# EAGLE schematic CC2640_interface (EAGLE 6.6.0)

## Sheet 1 of 2
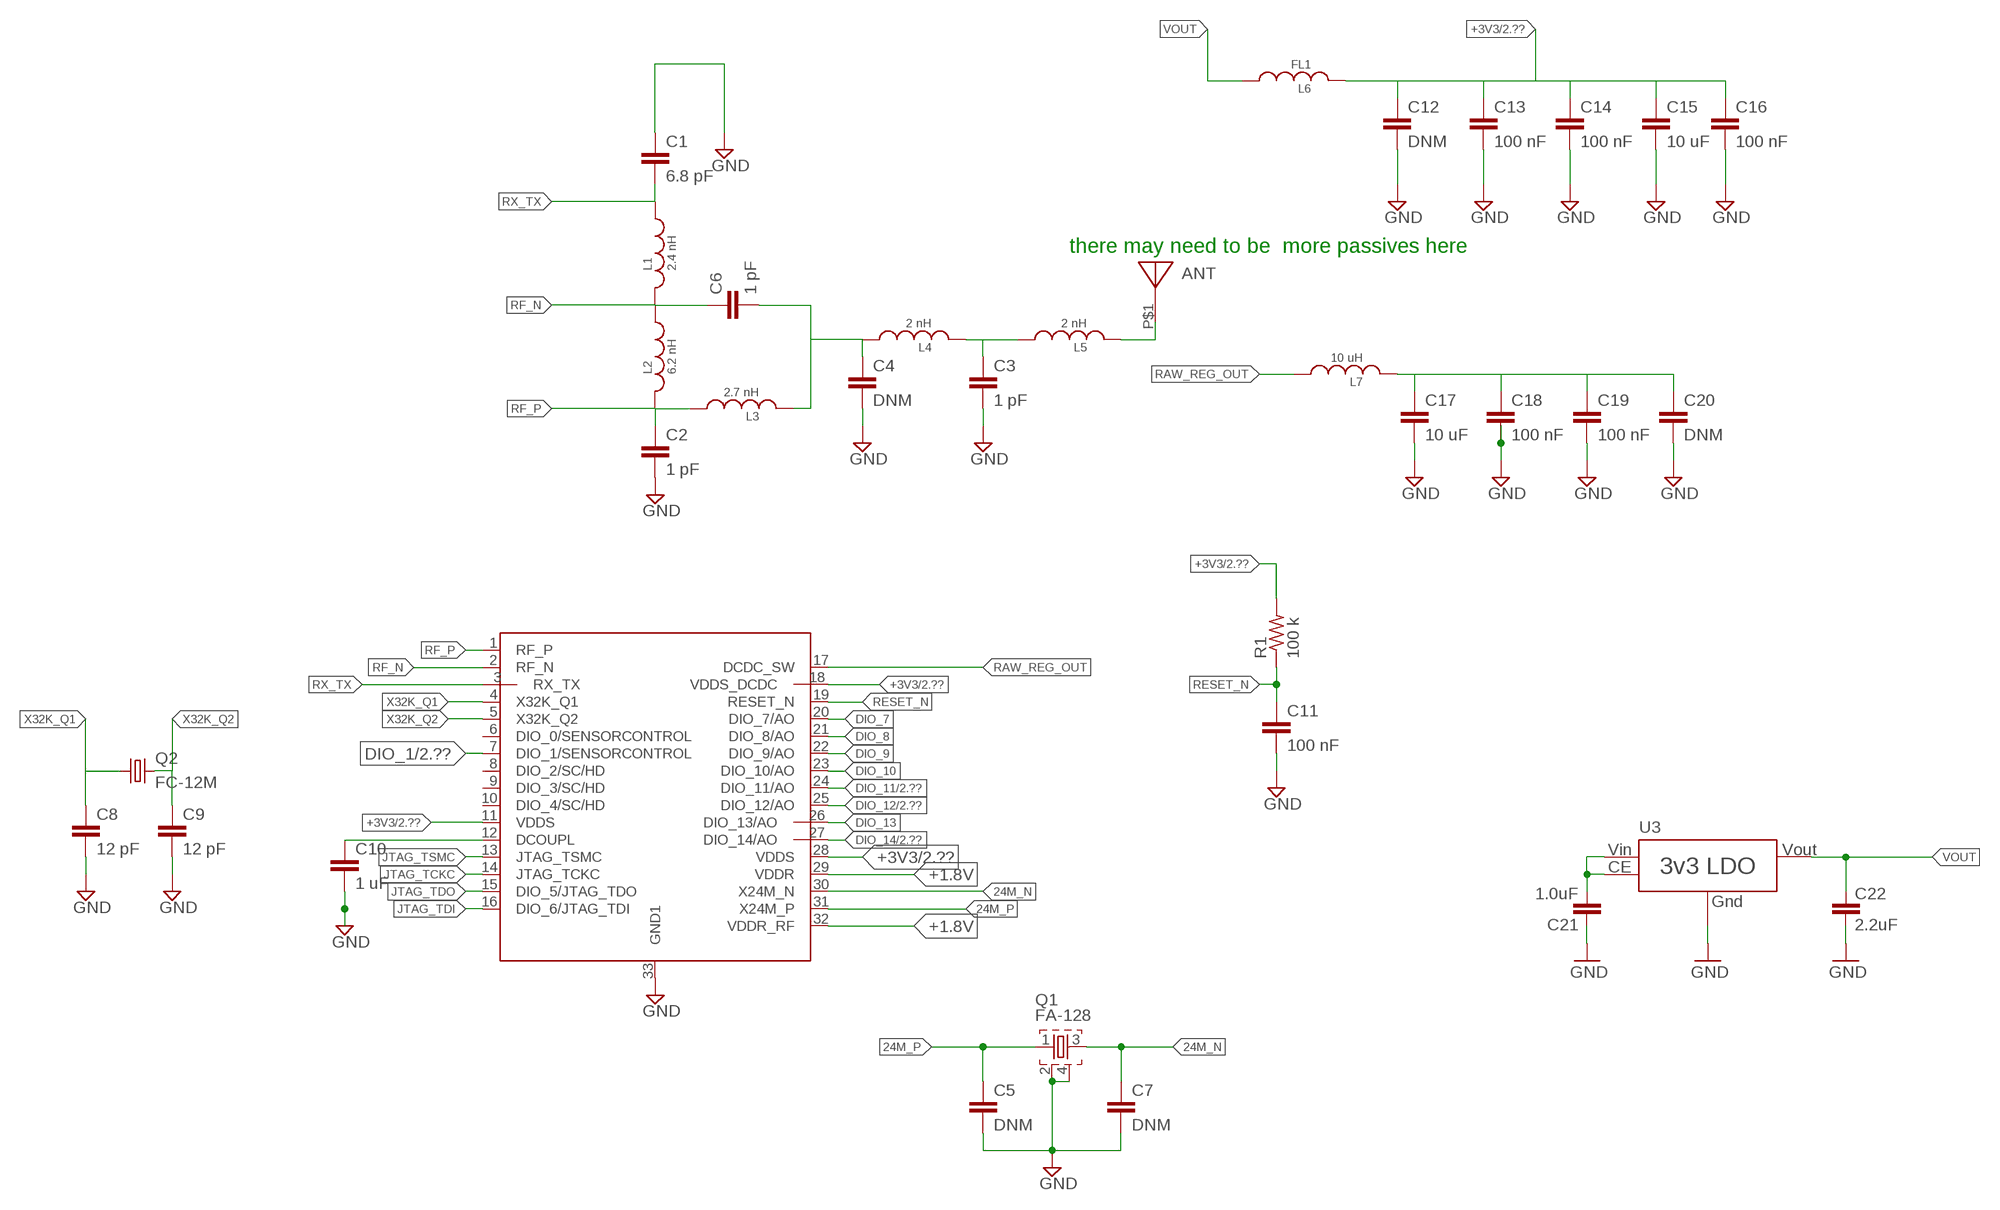
[diagram p0: schematic, sheet 1]

### Parts
ANT  2450AT18A100  [2450AT18A100]
C1  6.8 pF  C-EUC0402  [C0402]
C2  1 pF  C-EUC0402  [C0402]
C3  1 pF  C-EUC0402  [C0402]
C4  DNM  C-EUC0402  [C0402]
C5  DNM  C-EUC0402  [C0402]
C6  1 pF  C-EUC0402  [C0402]
C7  DNM  C-EUC0402  [C0402]
C8  12 pF  C-EUC0402  [C0402]
C9  12 pF  C-EUC0402  [C0402]
C10  1 uF  C-EUC0402  [C0402]
C11  100 nF  C-EUC0402  [C0402]
C12  DNM  C-EUC0402  [C0402]
C13  100 nF  C-EUC0402  [C0402]
C14  100 nF  C-EUC0402  [C0402]
C15  10 uF  C-EUC0402  [C0402]
C16  100 nF  C-EUC0402  [C0402]
C17  10 uF  C-EUC0402  [C0402]
C18  100 nF  C-EUC0402  [C0402]
C19  100 nF  C-EUC0402  [C0402]
C20  DNM  C-EUC0402  [C0402]
C21  1.0uF  C-EUC0805  [C0805]
C22  2.2uF  C-EUC0805  [C0805]
L1  2.4 nH  INDUCTOR0603  [0603_CAP]
L2  6.2 nH  INDUCTOR0603  [0603_CAP]
L3  2.7 nH  INDUCTOR0603  [0603_CAP]
L4  2 nH  INDUCTOR0603  [0603_CAP]
L5  2 nH  INDUCTOR0603  [0603_CAP]
L6  FL1  INDUCTOR0603  [0603_CAP]
L7  10 uH  INDUCTOR0603  [0603_CAP]
Q1  FA-128  [FA-128]
Q2  FC-12M  [FC-12M]
R1  100 k  R-US_R0402  [R0402]
U3  XC6210  [SOT-25]
U$1  CC2640-5MM  [S-PVQFN-N32]

### Nets
24M_N: C7.1 Q1.3 U$1.30(X24M_N)
24M_P: C5.1 Q1.1 U$1.31(X24M_P)
+1.8V: C17.1 C18.1 C19.1 C20.1 L7.2 U$1.29(VDDR) U$1.32(VDDR_RF)
+3V3: C12.1 C13.1 C14.1 C15.1 C16.1 L6.2 R1.2 U$1.11(VDDS) U$1.18(VDDS_DCDC) U$1.28(VDDS) ; also sheet 2
DCOUPLE_ME: C10.1 U$1.12(DCOUPL)
DIO_1: U$1.7(DIO_1/SENSORCONTROL) ; also sheet 2
DIO_7: U$1.20(DIO_7/AO)
DIO_8: U$1.21(DIO_8/AO)
DIO_9: U$1.22(DIO_9/AO)
DIO_10: U$1.23(DIO_10/AO)
DIO_11: U$1.24(DIO_11/AO) ; also sheet 2
DIO_12: U$1.25(DIO_12/AO) ; also sheet 2
DIO_13: U$1.26(DIO_13/AO)
DIO_14: U$1.27(DIO_14/AO) ; also sheet 2
GND: C1.1 C2.2 C3.2 C4.2 C5.2 C7.2 C8.2 C9.2 C10.2 C11.2 C12.2 C13.2 C14.2 C15.2 C16.2 C17.2 C18.2 C19.2 C20.2 C21.1 C22.2 Q1.2 Q1.4 U3.2(GND) U$1.33(GND1) ; also sheet 2
JTAG_TCKC: U$1.14(JTAG_TCKC)
JTAG_TDI: U$1.16(DIO_6/JTAG_TDI)
JTAG_TDO: U$1.15(DIO_5/JTAG_TDO)
JTAG_TSMC: U$1.13(JTAG_TSMC)
N$4: C4.1 C6.2 L3.2 L4.1
N$5: C3.1 L4.2 L5.1
N$7: ANT.P$1 L5.2
RAW_REG_OUT: L7.1 U$1.17(DCDC_SW)
RESET_N: C11.1 R1.1 U$1.19(RESET_N)
RF_N: C6.1 L1.2 L2.1 U$1.2(RF_N)
RF_P: C2.1 L2.2 L3.1 U$1.1(RF_P)
RX_TX: C1.2 L1.1 U$1.3(RX_TX)
VBATT: C21.2 U3.1(VIN) U3.3(CE)
VOUT: C22.1 L6.1 U3.5(VOUT)
X32K_Q1: C8.1 Q2.1 U$1.4(X32K_Q1)
X32K_Q2: C9.1 Q2.2 U$1.5(X32K_Q2)
Unconnected: U$1.6(DIO_0/SENSORCONTROL) U$1.8(DIO_2/SC/HD) U$1.9(DIO_3/SC/HD) U$1.10(DIO_4/SC/HD)

### Notes on the sheet
- there may need to be  more passives here

## Sheet 2 of 2
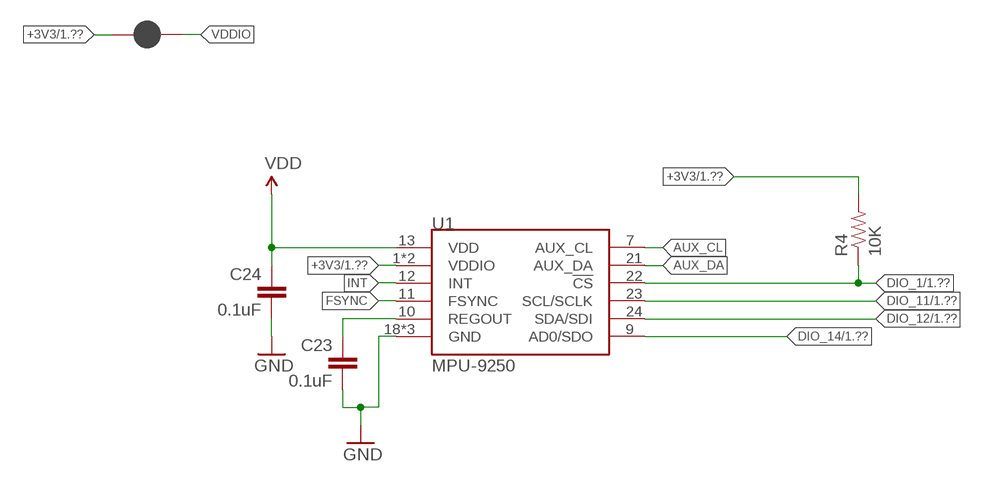
[diagram p1: schematic, sheet 2]

### Parts
C23  0.1uF  0.1UF-25V(+80/-20%)(0603)  [0603-CAP]
C24  0.1uF  0.1UF-25V(+80/-20%)(0603)  [0603-CAP]
R4  10K  10KOHM-1/10W-1%(0603)0603  [0603-RES]
SJ1  JUMPER-PAD-2-NC_BY_PASTEFULL-BOX-SILK  [PAD-JUMPER-2-NC_BY_PASTE_YES_SILK_FULL_BOX]
U1  MPU-9250  [QFN24_PAD]

### Nets
+3V3: C24.1 R4.2 SJ1.1 U1.1(VDDIO) U1.8(VDDIO) U1.13(VDD) ; supply symbol labelled VDD ; also sheet 1
ADSD_STUB: U1.9(AD0/SDO)
AUX_CL: U1.7(AUX_CL)
AUX_DA: U1.21(AUX_DA)
DIO_1: R4.1 U1.22(!CS) ; also sheet 1
DIO_11: U1.23(SCL/SCLK) ; also sheet 1
DIO_12: U1.24(SDA/SDI) ; also sheet 1
FSYNC: U1.11(FSYNC)
GND: C23.2 C24.2 U1.18(GND) U1.20(GND) U1.CENTER(GND) ; also sheet 1
INT: U1.12(INT)
REGOUT: C23.1 U1.10(REGOUT)
VDDIO: SJ1.2

## Library data of the parts
ANT = Johanson_antenna:2450AT18A100
C1-C20 = rcl:C-EU: CAPACITOR, European symbol
C21 C22 = Jon_LIB:C-EU: CAPACITOR, European symbol
C23 C24 = SparkFun-Capacitors:0.1UF-25V(+80/-20%)(0603): CAP-00810 Ceramic Standard decoupling cap; PROD_ID: CAP-00810
L1-L7 = passives:INDUCTOR: A very specific inductor
Q1 = crystal:FA-: MHz RANGE CRYSTAL UNIT Source: Epson Toyocom
Q2 = crystal:FC-12M: kHz RANGE CRYSTAL UNIT LOW PROFILE SMD Source: Epson Toyocom FC-12M.pdf
R1 = rcl:R-US_: RESISTOR, American symbol
R4 = SparkFun-Resistors:10KOHM-1/10W-1%(0603): RES-00824; PROD_ID: RES-00824
SJ1 = SparkFun-Passives:JUMPER-PAD-2-NC_BY_PASTE
U1 = Testing:MPU-9250: NC pin 19. 2-6 & 14-17 not internally connected. May be used for PCB trace routing.; PROD_ID: IC-13192
U3 = MAAV:XC6210; DIGIKEY#: 893-1075-1-ND
U$1 = chips:CC2640-5MM